# EAGLE schematic Simple_2in2_flex (EAGLE 9.3.0)
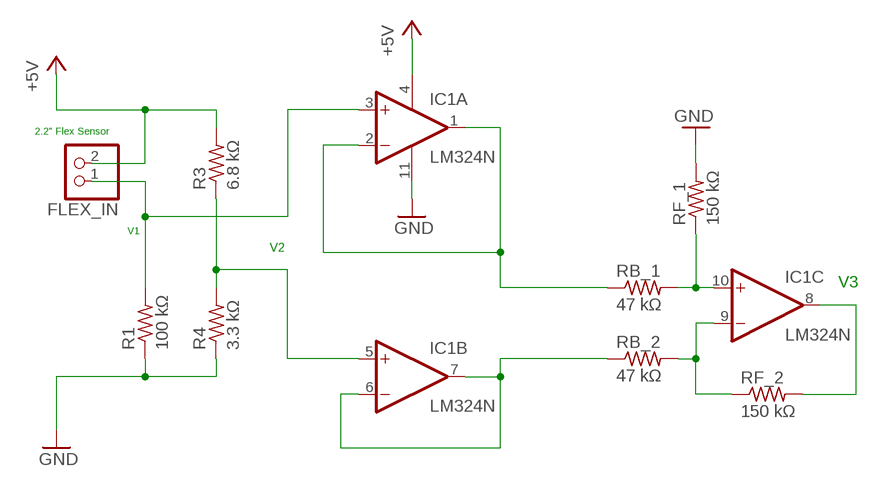
[diagram p0: schematic, sheet 1]

## Parts
FLEX_IN  PINHD-1X2  [1X02]
IC1  LM324N  [DIL14]
R1  100 kΩ  R-US_0204/5  [0204/5]
R3  6.8 kΩ  R-US_0204/5  [0204/5]
R4  3.3 kΩ  R-US_0204/5  [0204/5]
RB_1  47 kΩ  R-US_0204/5  [0204/5]
RB_2  47 kΩ  R-US_0204/5  [0204/5]
RF_1  150 kΩ  R-US_0204/5  [0204/5]
RF_2  150 kΩ  R-US_0204/5  [0204/5]

## Nets
+5V: FLEX_IN.2 IC1.4(P:V+) R3.2
GND: IC1.11(P:V-) R1.1 R4.1 RF_1.2
N$1: IC1.10(C:+IN) RB_1.2 RF_1.1
N$2: IC1.5(B:+IN) R3.1 R4.2
N$4: IC1.6(B:-IN) IC1.7(B:OUT) RB_2.1
N$5: IC1.1(A:OUT) IC1.2(A:-IN) RB_1.1
N$7: IC1.9(C:-IN) RB_2.2 RF_2.1
N$9: IC1.8(C:OUT) RF_2.2
V1: FLEX_IN.1 IC1.3(A:+IN) R1.2
Unconnected: IC1.12(D:+IN) IC1.13(D:-IN) IC1.14(D:OUT)

## Notes on the sheet
- 2.2" Flex Sensor
- V1
- V2
- V3

## Library data of the parts
FLEX_IN = pinhead:PINHD-1X2: PIN HEADER
IC1 = linear:LM324: OP AMP
R1 R3 R4 = rcl:R-US_: RESISTOR, American symbol; SPICEPREFIX: R
RB_1 RB_2 RF_1 RF_2 = resistor:R-US_: RESISTOR, American symbol